# EAGLE schematic Sedna Power Board (EAGLE 9.6.0)
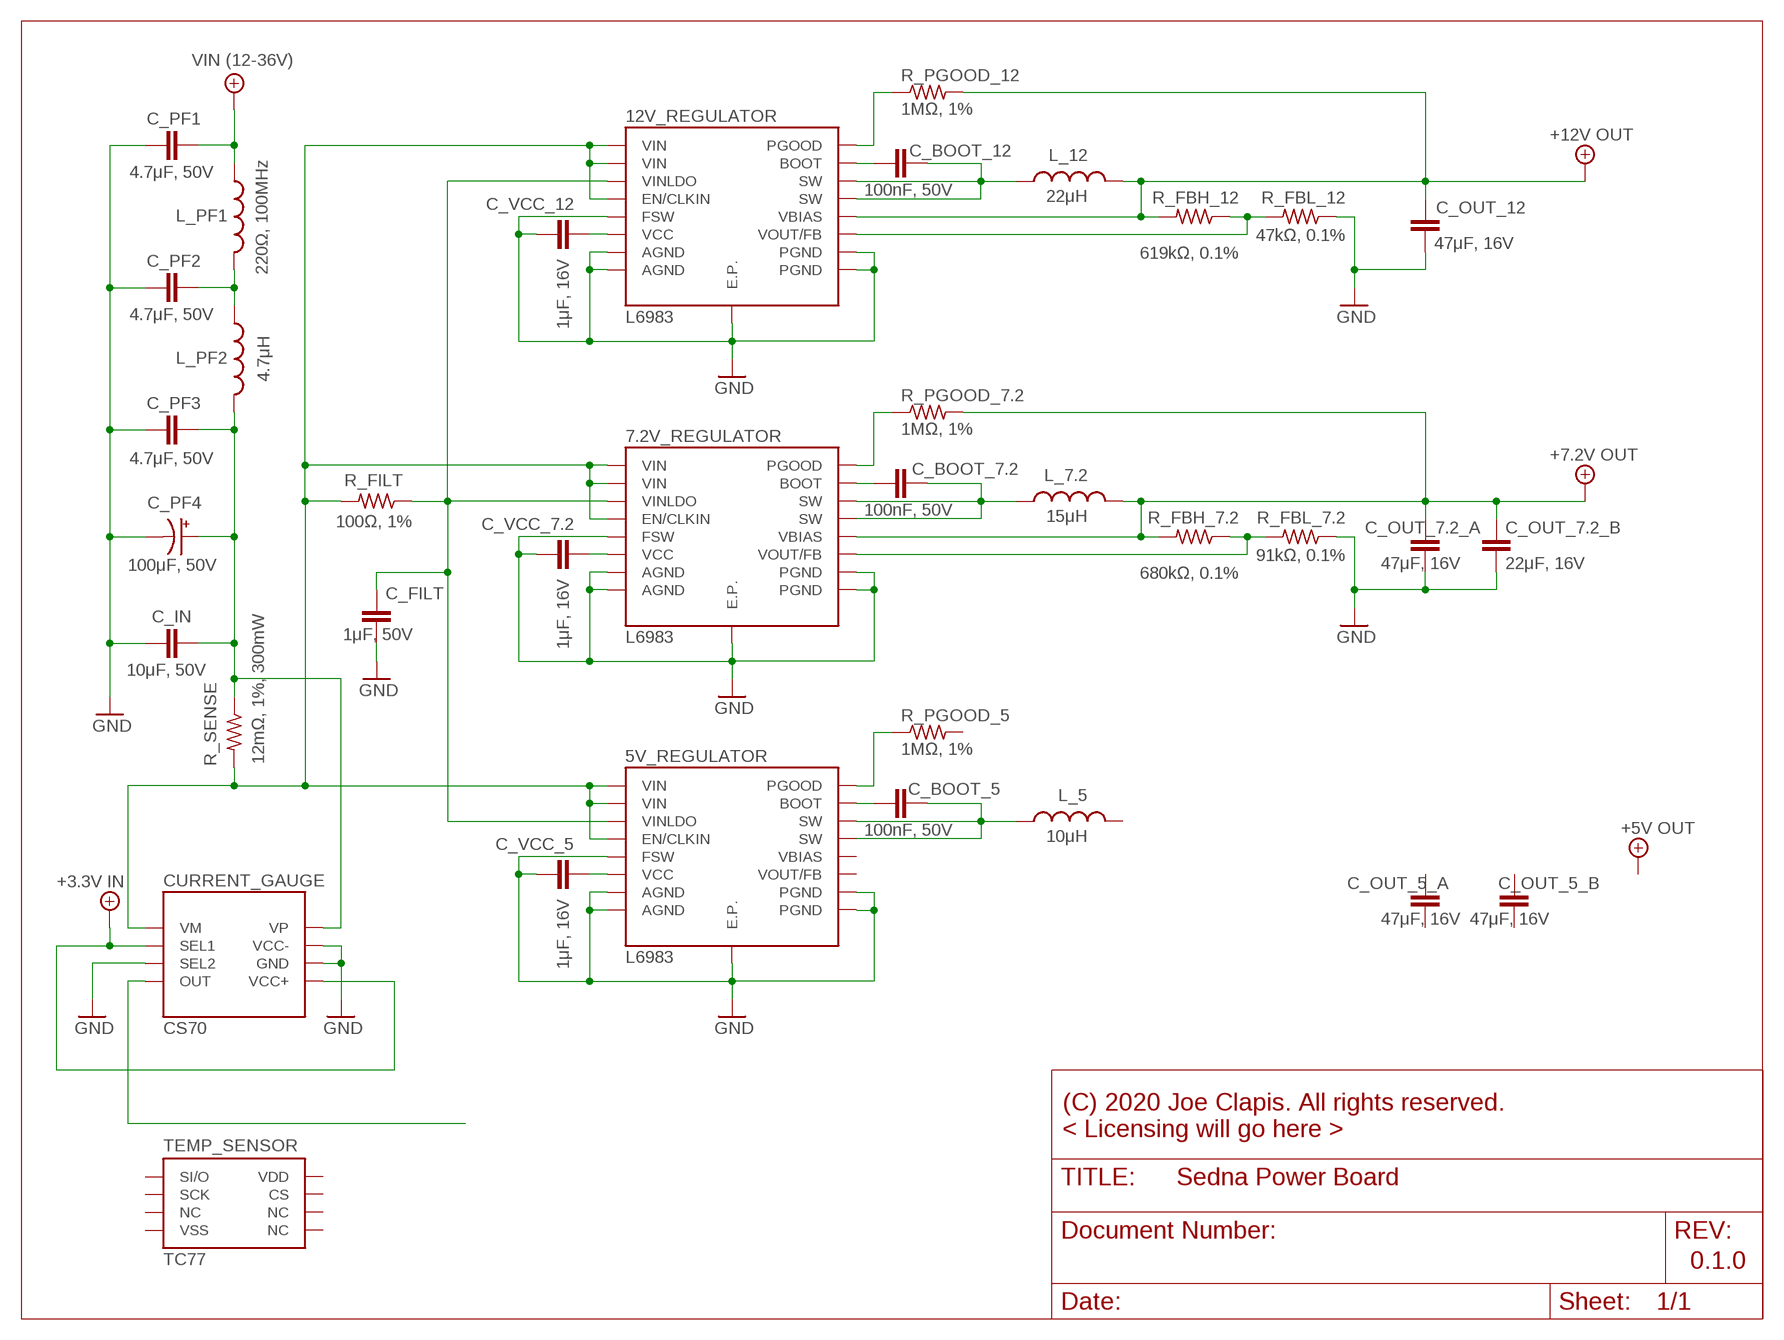
[diagram p0: schematic, sheet 1]

## Parts
5V_REGULATOR  L6983  [L6983]
7.2V_REGULATOR  L6983  [L6983]
12V_REGULATOR  L6983  [L6983]
C_BOOT_5  100nF, 50V  C-EUC0603  [C0603]
C_BOOT_7.2  100nF, 50V  C-EUC0603  [C0603]
C_BOOT_12  100nF, 50V  C-EUC0603  [C0603]
C_FILT  1μF, 50V  C-EUC0805  [C0805]
C_IN  10μF, 50V  C-EUC1206  [C1206]
C_OUT_5_A  47μF, 16V  GRM32  [GRM_32]
C_OUT_5_B  47μF, 16V  GRM32  [GRM_32]
C_OUT_7.2_A  47μF, 16V  GRM32  [GRM_32]
C_OUT_7.2_B  22μF, 16V  GRM31  [GRM_31]
C_OUT_12  47μF, 16V  GRM32  [GRM_32]
C_PF1  4.7μF, 50V  C-EUC1206  [C1206]
C_PF2  4.7μF, 50V  C-EUC1206  [C1206]
C_PF3  4.7μF, 50V  C-EUC1206  [C1206]
C_PF4  100μF, 50V  CPOL-USG  [PANASONIC_G]
C_VCC_5  1μF, 16V  C-EUC0805  [C0805]
C_VCC_7.2  1μF, 16V  C-EUC0805  [C0805]
C_VCC_12  1μF, 16V  C-EUC0805  [C0805]
CURRENT_GAUGE  CS70  [TSSOP8]
L_5  10μH  PA4343_FP2  [PA4343_FP2]
L_7.2  15μH  PA4343_FP2  [PA4343_FP2]
L_12  22μH  PA4343_FP2  [PA4343_FP2]
L_PF1  220Ω, 100MHz  L-USL2012C  [L2012C]
L_PF2  4.7μH  L-USL2012C  [L2012C]
R_FBH_7.2  680kΩ, 0.1%  R-US_R0805  [R0805]
R_FBH_12  619kΩ, 0.1%  R-US_R0805  [R0805]
R_FBL_7.2  91kΩ, 0.1%  R-US_R0805  [R0805]
R_FBL_12  47kΩ, 0.1%  R-US_R0805  [R0805]
R_FILT  100Ω, 1%  R-US_R0402  [R0402]
R_PGOOD_5  1MΩ, 1%  R-US_R0805  [R0805]
R_PGOOD_7.2  1MΩ, 1%  R-US_R0805  [R0805]
R_PGOOD_12  1MΩ, 1%  R-US_R0805  [R0805]
R_SENSE  12mΩ, 1%, 300mW  WSK1206  [WSK1206]
TEMP_SENSOR  TC77  [SOIC8]

## Nets
+10V: 7.2V_REGULATOR.6_VBIAS(VBIAS) 12V_REGULATOR.6_VBIAS(VBIAS) C_OUT_7.2_A.P$1 C_OUT_7.2_B.P$1 C_OUT_12.P$1 C_PF1.2 CURRENT_GAUGE.2(SEL1) CURRENT_GAUGE.5(VCC+) L_7.2.2 L_12.2 L_PF1.1 R_FBH_7.2.2 R_FBH_12.2 R_PGOOD_7.2.2 R_PGOOD_12.2 ; supply symbol labelled +7.2V OUT, VIN (12-36V), +12V OUT, +3.3V IN
GND: 5V_REGULATOR.3_AGND(AGND) 5V_REGULATOR.8_FSW(FSW) 5V_REGULATOR.10_AGND(AGND) 5V_REGULATOR.13_PGND(PGND) 5V_REGULATOR.16_PGND(PGND) 5V_REGULATOR.E.P. 7.2V_REGULATOR.3_AGND(AGND) 7.2V_REGULATOR.8_FSW(FSW) 7.2V_REGULATOR.10_AGND(AGND) 7.2V_REGULATOR.13_PGND(PGND) 7.2V_REGULATOR.16_PGND(PGND) 7.2V_REGULATOR.E.P. 12V_REGULATOR.3_AGND(AGND) 12V_REGULATOR.8_FSW(FSW) 12V_REGULATOR.10_AGND(AGND) 12V_REGULATOR.13_PGND(PGND) 12V_REGULATOR.16_PGND(PGND) 12V_REGULATOR.E.P. C_FILT.1 C_IN.1 C_OUT_7.2_A.P$2 C_OUT_7.2_B.P$2 C_OUT_12.P$2 C_PF1.1 C_PF2.1 C_PF3.1 C_PF4.- C_VCC_5.1 C_VCC_7.2.1 C_VCC_12.1 CURRENT_GAUGE.3(SEL2) CURRENT_GAUGE.6(GND) CURRENT_GAUGE.7(VCC-) R_FBL_7.2.1 R_FBL_12.1
N$1: C_PF2.2 L_PF1.2 L_PF2.1
N$2: 12V_REGULATOR.9_VCC(VCC) C_VCC_12.2
N$3: 5V_REGULATOR.2_VINLDO(VINLDO) 7.2V_REGULATOR.2_VINLDO(VINLDO) 12V_REGULATOR.2_VINLDO(VINLDO) C_FILT.2 R_FILT.1
N$4: 7.2V_REGULATOR.9_VCC(VCC) C_VCC_7.2.2
N$5: 12V_REGULATOR.5_PGOOD(PGOOD) R_PGOOD_12.1
N$6: 12V_REGULATOR.11_BOOT(BOOT) C_BOOT_12.1
N$7: 12V_REGULATOR.14_SW(SW) 12V_REGULATOR.15_SW(SW) C_BOOT_12.2 L_12.1
N$8: 5V_REGULATOR.9_VCC(VCC) C_VCC_5.2
N$9: 7.2V_REGULATOR.11_BOOT(BOOT) C_BOOT_7.2.1
N$10: 7.2V_REGULATOR.14_SW(SW) 7.2V_REGULATOR.15_SW(SW) C_BOOT_7.2.2 L_7.2.1
N$11: 5V_REGULATOR.11_BOOT(BOOT) C_BOOT_5.1
N$12: 5V_REGULATOR.14_SW(SW) 5V_REGULATOR.15_SW(SW) C_BOOT_5.2 L_5.1
N$13: 5V_REGULATOR.1_VIN(VIN) 5V_REGULATOR.4_EN/CLKIN(EN/CLKIN) 5V_REGULATOR.12_VIN(VIN) 7.2V_REGULATOR.1_VIN(VIN) 7.2V_REGULATOR.4_EN/CLKIN(EN/CLKIN) 7.2V_REGULATOR.12_VIN(VIN) 12V_REGULATOR.1_VIN(VIN) 12V_REGULATOR.4_EN/CLKIN(EN/CLKIN) 12V_REGULATOR.12_VIN(VIN) CURRENT_GAUGE.1(VM) R_FILT.2 R_SENSE.P$3 R_SENSE.P$4
N$14: 7.2V_REGULATOR.5_PGOOD(PGOOD) R_PGOOD_7.2.1
N$15: 5V_REGULATOR.5_PGOOD(PGOOD) R_PGOOD_5.1
N$17: 12V_REGULATOR.7_FB/VOUT(VOUT/FB) R_FBH_12.1 R_FBL_12.2
N$19: 7.2V_REGULATOR.7_FB/VOUT(VOUT/FB) R_FBH_7.2.1 R_FBL_7.2.2
N$20: C_IN.2 C_PF3.2 C_PF4.+ CURRENT_GAUGE.8(VP) L_PF2.2 R_SENSE.P$1 R_SENSE.P$2
N$21: CURRENT_GAUGE.4(OUT)
Unconnected: 5V_REGULATOR.6_VBIAS(VBIAS) 5V_REGULATOR.7_FB/VOUT(VOUT/FB) C_OUT_5_A.P$1 C_OUT_5_A.P$2 C_OUT_5_B.P$1 C_OUT_5_B.P$2 L_5.2 R_PGOOD_5.2 TEMP_SENSOR.1(SI/O) TEMP_SENSOR.2(SCK) TEMP_SENSOR.3(NC) TEMP_SENSOR.5(NC) TEMP_SENSOR.6(NC) TEMP_SENSOR.7(CS)

## Notes on the sheet
- (C) 2020 Joe Clapis. All rights reserved.
  < Licensing will go here >
- 0.1.0

## Power pins joined to a net without a drawn wire
VDD: TEMP_SENSOR.8(VDD)
VSS: TEMP_SENSOR.4(VSS)

## Library data of the parts
5V_REGULATOR 7.2V_REGULATOR 12V_REGULATOR = Sedna Components:L6983: The L6983 is a configurable DC-DC step-down regulator, bringing 3.5-38V down to 0.85-Vin. It supports up to 3A of output current, and comes in a QFN16 package. https://my.st.com/resource/en/datasheet/l6983.pdf
C_BOOT_5 C_BOOT_7.2 C_BOOT_12 C_FILT C_IN C_PF1-C_PF3 C_VCC_5 C_VCC_7.2 C_VCC_12 = rcl:C-EU: CAPACITOR, European symbol; SPICEPREFIX: C
C_OUT_5_A C_OUT_5_B C_OUT_7.2_A C_OUT_7.2_B C_OUT_12 = Sedna Components:GRM: The Murata GRM series of SMD ceramic capacitors: https://www.mouser.com/datasheet/2/281/murata_03052018_GRM_Series_1-1310166.pdf
C_PF4 = rcl:CPOL-US: POLARIZED CAPACITOR, American symbol; SPICEPREFIX: C
CURRENT_GAUGE = Sedna Components:CS70
L_5 L_7.2 L_12 = Sedna Components:PA4343_FP2: The Pulse PA4343.XXXNLT is a series of shielded SMT power inductors: https://www.mouser.com/datasheet/2/336/P770-1526930.pdf
L_PF1 L_PF2 = rcl:L-US: INDUCTOR, American symbol; SPICEPREFIX: L
R_FBH_7.2 R_FBH_12 R_FBL_7.2 R_FBL_12 R_FILT R_PGOOD_5 R_PGOOD_7.2 R_PGOOD_12 = rcl:R-US_: RESISTOR, American symbol; SPICEPREFIX: R
R_SENSE = Sedna Components:WSK1206: The Vishay WSK1206 series of current sensing resistors, with a 1206 (3216) case size and 4-terminal design: https://www.mouser.com/datasheet/2/427/wsk120618-1763045.pdf
TEMP_SENSOR = Sedna Components:TC77: The TC77 is a digital temperature sensor: https://www.mouser.com/datasheet/2/268/20092a-72501.pdf